# Altium schematic sheet 西門-貓咪-記憶之花.SchDoc
size A3
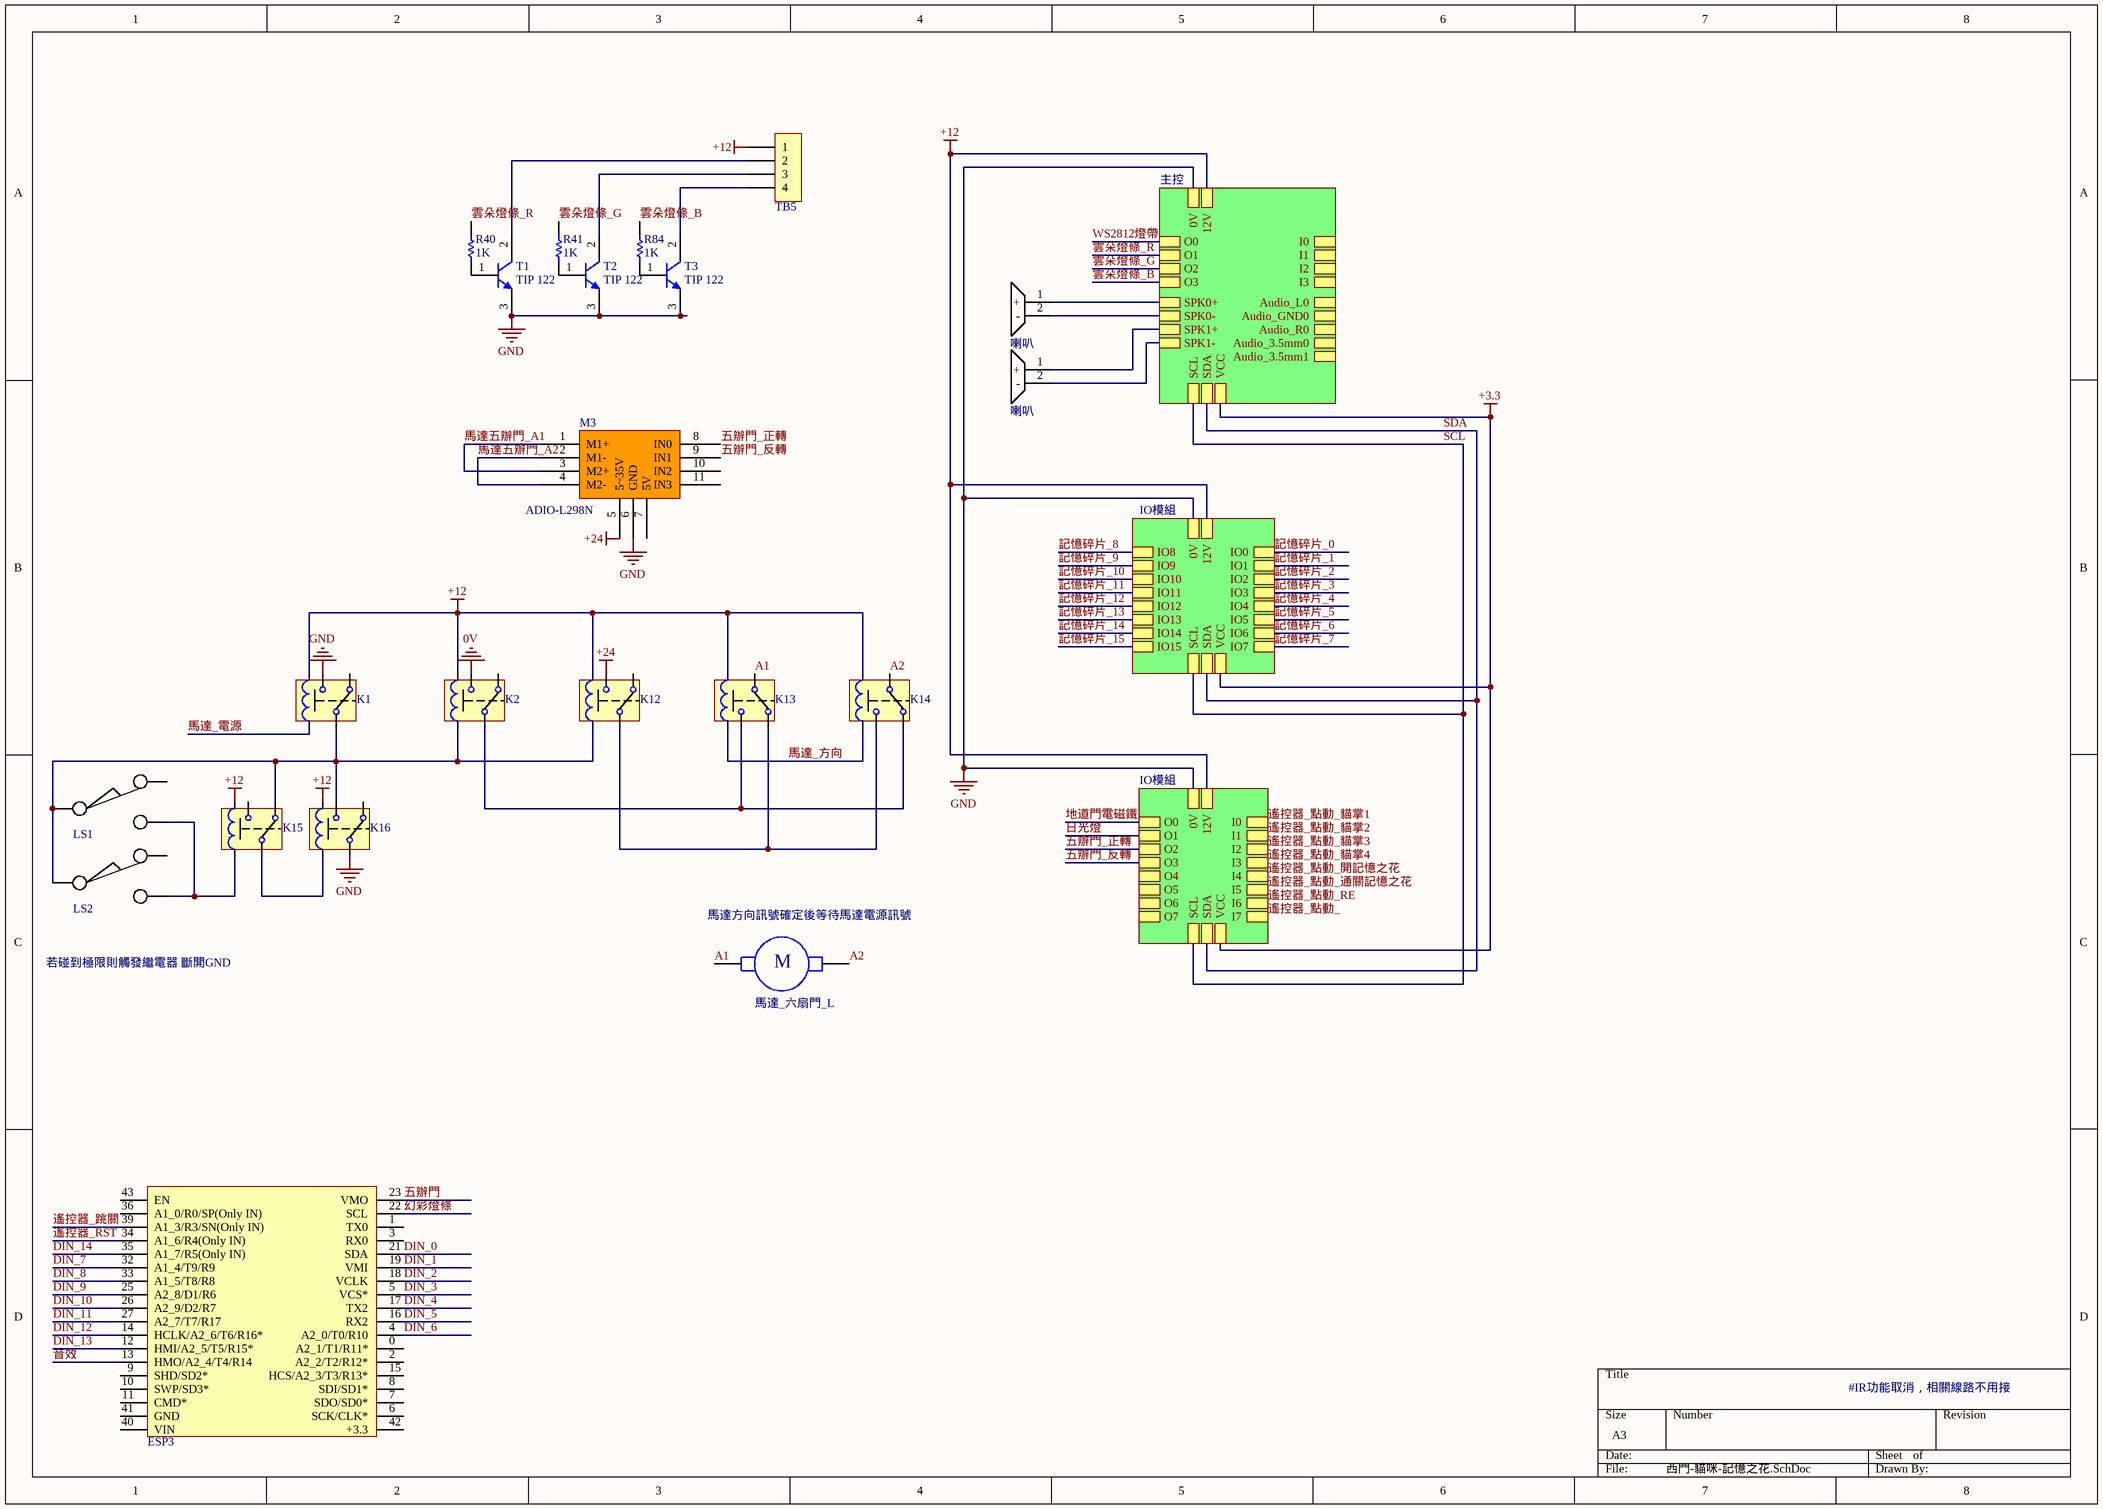
[diagram p0: 西門-貓咪-記憶之花.SchDoc]

## Parts
B16  喇叭  [Buzzer_12085]
B17  喇叭  [Buzzer_12085]
ESP3  ESP32_Node32s  [ESP32 Module]  (value not drawn)
K1  G2R-1-24VDC  [RELAY-G2R-1]  (value not drawn)
K2  G2R-1-24VDC  [RELAY-G2R-1]  (value not drawn)
K12  G2R-1-24VDC  [RELAY-G2R-1]  (value not drawn)
K13  G2R-1-24VDC  [RELAY-G2R-1]  (value not drawn)
K14  G2R-1-24VDC  [RELAY-G2R-1]  (value not drawn)
K15  G2R-1-24VDC  [RELAY-G2R-1]  (value not drawn)
K16  G2R-1-24VDC  [RELAY-G2R-1]  (value not drawn)
LS1  Limit switch  (value not drawn)
LS2  Limit switch  (value not drawn)
M3  ADIO-L298N  [L298N]
MD6  馬達_六扇門_L
R40  1K  [Res-0201]
R41  1K  [Res-0201]
R84  1K  [Res-0201]
T1  TIP 122  [TO-220 1>2>3]
T2  TIP 122  [TO-220 1>2>3]
T3  TIP 122  [TO-220 1>2>3]
TB5  KF2EDGRT-5.08_4P  [Terminal block(KF2EDGR-3.81_4P)]  (value not drawn)

## Sub-sheets
IO模組 = IO模組_MCP23017_20240819.SchDoc: VCC, 12V, 0V, SCL, SDA, IO15, IO14, IO10, IO0, IO3, IO4, IO5, IO8, IO11, IO6, IO7, IO12, IO13, IO2, IO1, IO9
IO模組 = IO模組_MCP23017_20240815.SchDoc: O5, O7, O3, I6, I7, O4, O1, I0, I1, I2, I3, I4, I5, O6, O2, O0, VCC, 12V, 0V, SCL, SDA
主控 = ESP32主控_20240812.SchDoc: 12V, SDA, VCC, 0V, SCL, O3, O2, O1, O0, I3, I2, I1, I0, SPK0+, Audio_3.5mm1, Audio_L0, SPK0-, Audio_R0, SPK1+, SPK1-, Audio_3.5mm0, Audio_GND0

## Nets
0V: K2.2(NO)
+3.3: sheet 主控/VCC, sheet IO模組/VCC, sheet IO模組/VCC
+12: K1.5(A2) K2.5(A2) K12.5(A2) K13.4(A1) K14.4(A1) K15.5(A2) K16.5(A2) TB5.1 ; sheet 主控/12V, sheet IO模組/12V, sheet IO模組/12V
+24: K12.2(NO) M3.5(5~35V)
GND: K1.2(NO) K16.1(COM) M3.6(GND) T1.3(E) T2.3(E) T3.3(E) ; sheet 主控/0V, sheet IO模組/0V, sheet IO模組/0V
A1: K13.1(COM) MD6.4
A2: K14.1(COM) MD6.4
DIN_0: ESP3.21(SDA)
DIN_1: ESP3.19(VMI)
DIN_2: ESP3.18(VCLK)
DIN_3: ESP3.5(VCS*)
DIN_4: ESP3.17(TX2)
DIN_5: ESP3.16(RX2)
DIN_6: ESP3.4(A2_0/T0/R10)
DIN_7: ESP3.32(A1_4/T9/R9)
DIN_8: ESP3.33(A1_5/T8/R8)
DIN_9: ESP3.25(A2_8/D1/R6)
DIN_10: ESP3.26(A2_9/D2/R7)
DIN_11: ESP3.27(A2_7/T7/R17)
DIN_12: ESP3.14(HCLK/A2_6/T6/R16*)
DIN_13: ESP3.12(HMI/A2_5/T5/R15*)
DIN_14: ESP3.35(A1_7/R5(Only_IN))
SCL: sheet 主控/SCL, sheet IO模組/SCL, sheet IO模組/SCL
SDA: sheet 主控/SDA, sheet IO模組/SDA, sheet IO模組/SDA
WS2812燈帶: sheet 主控/O0
五辦門: ESP3.23(VMO)
五辦門_反轉: M3.9(IN1) ; sheet IO模組/O3
五辦門_正轉: M3.8(IN0) ; sheet IO模組/O2
地道門電磁鐵: sheet IO模組/O0
幻彩燈條: ESP3.22(SCL)
日光燈: sheet IO模組/O1
記憶碎片_0: sheet IO模組/IO0
記憶碎片_1: sheet IO模組/IO1
記憶碎片_2: sheet IO模組/IO2
記憶碎片_3: sheet IO模組/IO3
記憶碎片_4: sheet IO模組/IO4
記憶碎片_5: sheet IO模組/IO5
記憶碎片_6: sheet IO模組/IO6
記憶碎片_7: sheet IO模組/IO7
記憶碎片_8: sheet IO模組/IO8
記憶碎片_9: sheet IO模組/IO9
記憶碎片_10: sheet IO模組/IO10
記憶碎片_11: sheet IO模組/IO11
記憶碎片_12: sheet IO模組/IO12
記憶碎片_13: sheet IO模組/IO13
記憶碎片_14: sheet IO模組/IO14
記憶碎片_15: sheet IO模組/IO15
遙控器_RST: ESP3.34(A1_6/R4(Only_IN))
遙控器_跳關: ESP3.39(A1_3/R3/SN(Only_IN))
遙控器_點動_: sheet IO模組/I7
遙控器_點動_RE: sheet IO模組/I6
遙控器_點動_貓掌1: sheet IO模組/I0
遙控器_點動_貓掌2: sheet IO模組/I1
遙控器_點動_貓掌3: sheet IO模組/I2
遙控器_點動_貓掌4: sheet IO模組/I3
遙控器_點動_通關記憶之花: sheet IO模組/I5
遙控器_點動_開記憶之花: sheet IO模組/I4
雲朵燈條_B: R84.1 ; sheet 主控/O3
雲朵燈條_G: R41.2 ; sheet 主控/O2
雲朵燈條_R: R40.2 ; sheet 主控/O1
音效: ESP3.13(HMO/A2_4/T4/R14)
馬達_方向: K13.5(A2) K14.5(A2)
馬達_電源: K1.4(A1)
馬達五辦門_A1: M3.1(M1+) M3.3(M2+)
馬達五辦門_A2: M3.2(M1-) M3.4(M2-)
NetB16_1: B16.1(+) ; sheet 主控/SPK0+
NetB16_2: B16.2(-) ; sheet 主控/SPK0-
NetB17_1: B17.1(+) ; sheet 主控/SPK1+
NetB17_2: B17.2(-) ; sheet 主控/SPK1-
NetK1_1: K1.1(COM) K2.4(A1) K12.4(A1) K15.3(NC) K16.2(NO) LS1.1 LS2.1
NetK2_1: K2.1(COM) K13.2(NO) K14.3(NC)
NetK12_1: K12.1(COM) K13.3(NC) K14.2(NO)
NetK15_1: K15.1(COM) K16.4(A1)
NetK15_4: K15.4(A1) LS1.2 LS2.2
NetR40_1: R40.1 T1.1(B)
NetR41_1: R41.1 T2.1(B)
NetR84_2: R84.2 T3.1(B)
NetT1_2: T1.2(C) TB5.2
NetT2_2: T2.2(C) TB5.3
NetT3_2: T3.2(C) TB5.4

Not connected (* = marked no-connect by the designer): ESP3 0(A2_1/T1/R11*) 1(TX0) 2(A2_2/T2/R12*) 3(RX0) 6(SCK/CLK*) 7(SDO/SD0*) 8(SDI/SD1*) 9(SHD/SD2*) 10(SWP/SD3*) 11(CMD*) 15(HCS/A2_3/T3/R13*) 36(A1_0/R0/SP(Only_IN)) 40(VIN) 41(GND) 42(+3.3) 43(EN); K1 3(NC); K2 3(NC); K12 3(NC); K15 2(NO); K16 3(NC); LS1 3; LS2 3; M3 7(5V) 10(IN2) 11(IN3)

## Notes on the sheet
- (near MD6) 馬達方向訊號確定後等待馬達電源訊號
- 若碰到極限則觸發繼電器 斷開GND
- #IR功能取消，相關線路不用接
- (in symbol Motor_DC) M

## Library data of the parts
B16 B17 = Buzzer: 無源蜂鳴器
ESP3 = ESP32_Node32s: WIFI通訊模組
K1 K2 K12-K16 = Relay: 繼電器
LS1 LS2 = Limit switch: 極限開關
M3 = L298N: 步進馬達控制、馬達正反轉模組; #1: 當驅動電壓高於12V，小於等於24V時，必須拔除板載5V輸出使能的跳線帽。然後在5V輸出埠外部接入5V電壓對L298N內部邏輯電路供電; ComponentLink1Description: datasheet; ComponentLink1URL: https://shop.cpu.com.tw/product/46920/info/
MD6 = Motor_DC: 直流馬達
R40 R41 R84 = Res: 電阻
T1-T3 = Transistor NPN: 電晶體_NPN; 9013: 9013; TIP 122: TIP 122
TB5 = Terminal block(4P): 端子台